# EAGLE design ME433_1 (EAGLE 9.3.2)
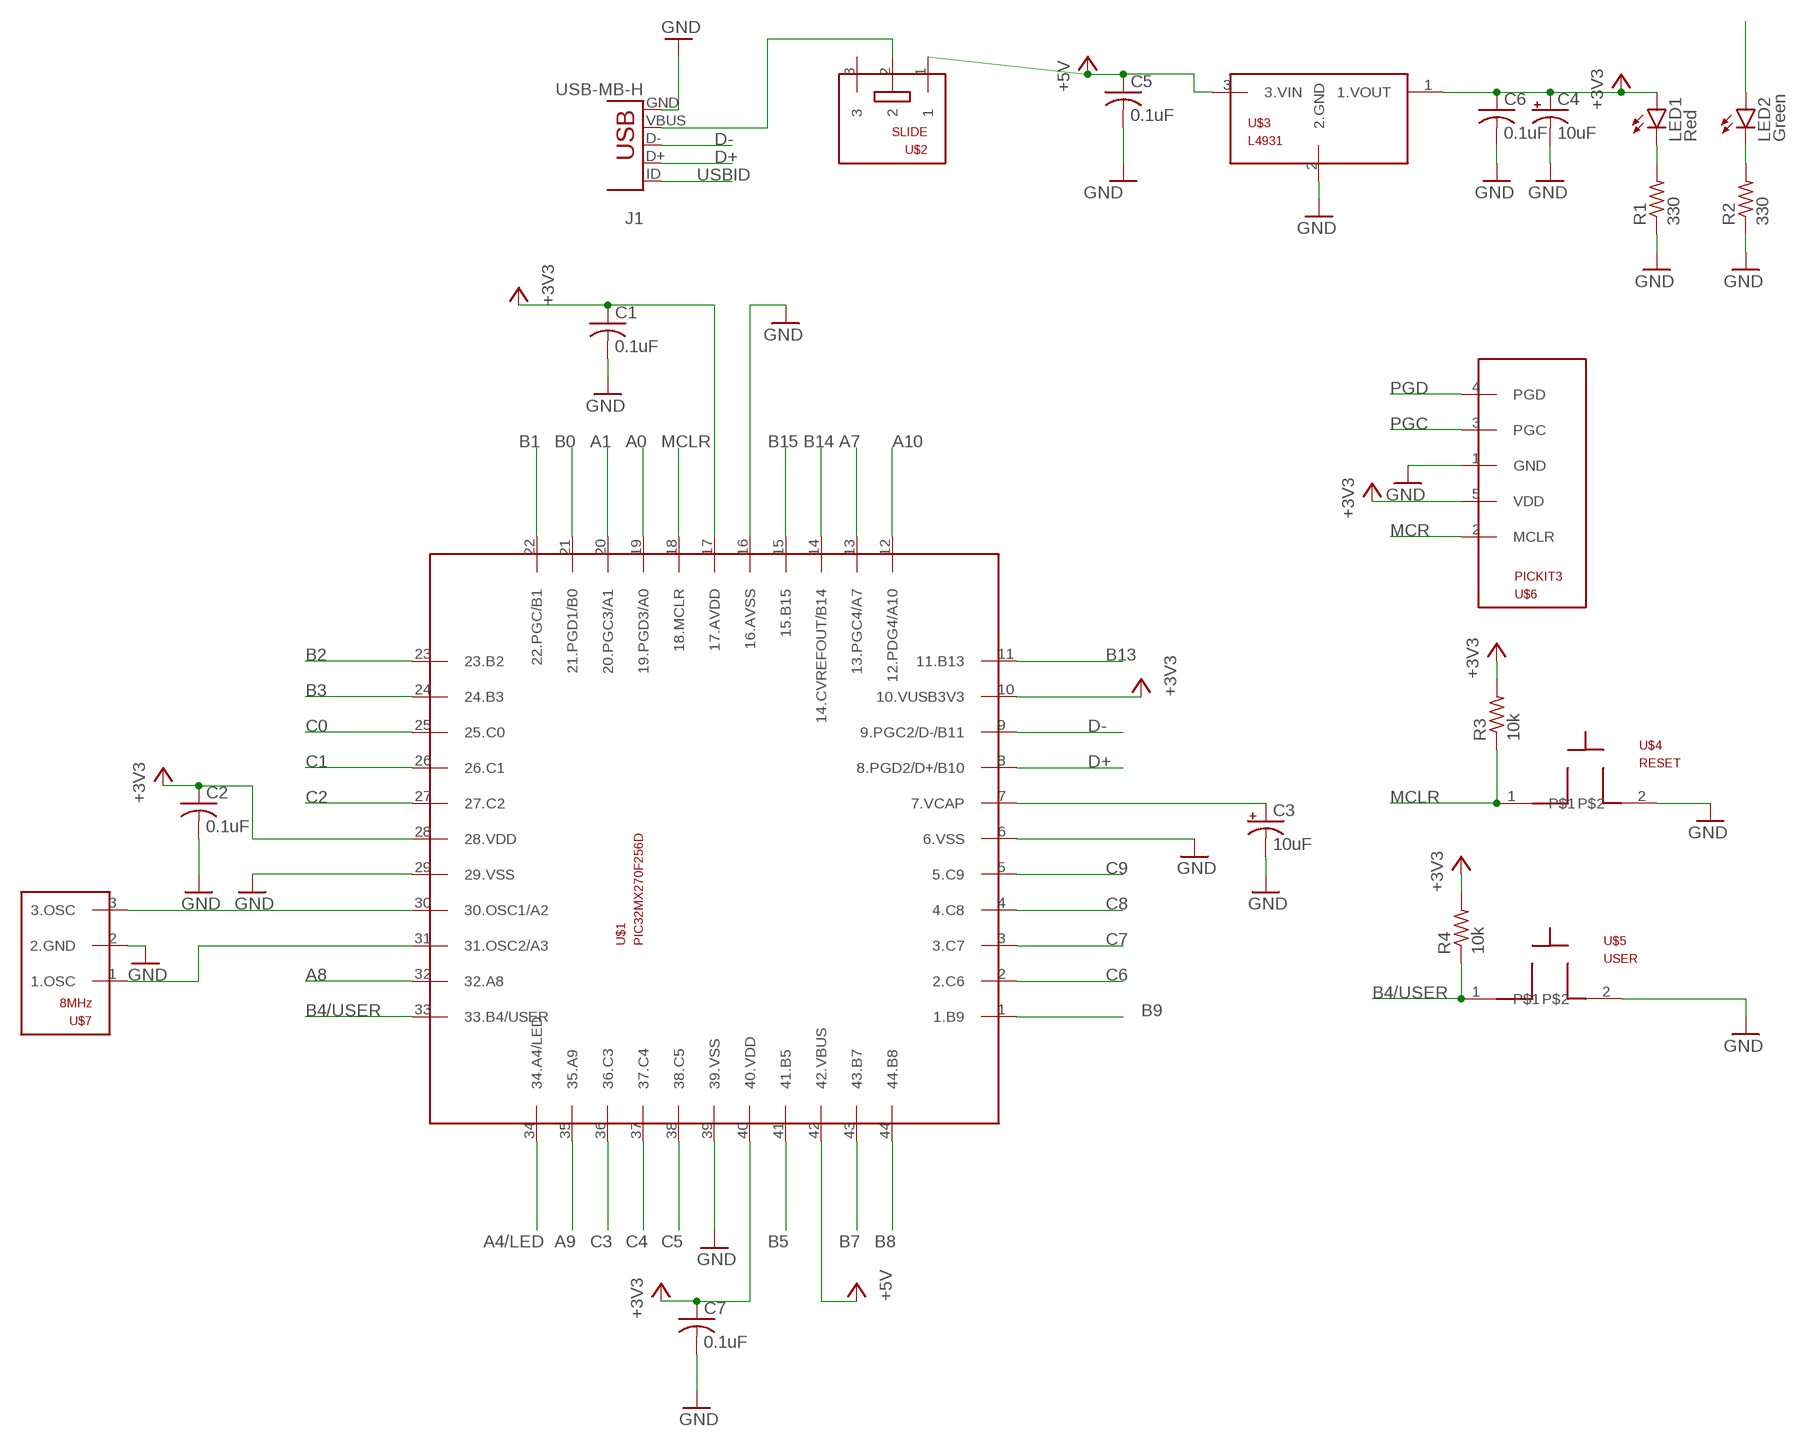
[diagram p0: schematic, sheet 1]

## Parts
C1  0.1uF  C-US025-025X050  [C025-025X050]
C2  0.1uF  C-US025-025X050  [C025-025X050]
C3  10uF  CPOL-USB45181B  [B45181B]
C4  10uF  CPOL-USB45181B  [B45181B]
C5  0.1uF  C-US025-025X050  [C025-025X050]
C6  0.1uF  C-US025-025X050  [C025-025X050]
C7  0.1uF  C-US025-025X050  [C025-025X050]
J1  USB-MB-H  [USB-MB-H]
LED1  Red  LED3MM  [LED3MM]
LED2  Green  LED3MM  [LED3MM]
R1  330  R-US_0207/10  [0207/10]
R2  330  R-US_0207/10  [0207/10]
R3  10k  R-US_0207/10  [0207/10]
R4  10k  R-US_0207/10  [0207/10]
U$1  PIC32MX270F256D  [TQFP44]
U$2  SLIDE  [SLIDE]
U$3  L4931  [1X03VREG]
U$4  RESET  PB  [PB]
U$5  USER  PB  [PB]
U$6  PICKIT3  [1X05]
U$7  8MHz  OSC  [OSC]

## Nets
+3V3: C1.1 C2.1 C4.+ C6.1 C7.1 LED1.A R3.2 R4.2 U$1.10(10.VUSB3V3) U$1.17(17.AVDD) U$1.28(28.VDD) U$1.40(40.VDD) U$3.1(1.VOUT) U$6.5(VDD)
+5V: C5.1 U$1.42(42.VBUS) U$2.1 U$3.3(3.VIN)
A0: U$1.19(19.PGD3/A0)
A1: U$1.20(20.PGC3/A1)
A4/LED: LED2.A U$1.34(34.A4/LED)
A7: U$1.13(13.PGC4/A7)
A8: U$1.32(32.A8)
A9: U$1.35(35.A9)
A10: U$1.12(12.PDG4/A10)
B0: U$1.21(21.PGD1/B0)
B1: U$1.22(22.PGC/B1)
B2: U$1.23(23.B2)
B3: U$1.24(24.B3)
B4/USER: R4.1 U$1.33(33.B4/USER) U$5.1
B5: U$1.41(41.B5)
B7: U$1.43(43.B7)
B8: U$1.44(44.B8)
B9: U$1.1(1.B9)
B13: U$1.11(11.B13)
B14: U$1.14(14.CVREFOUT/B14)
B15: U$1.15(15.B15)
C0: U$1.25(25.C0)
C1: U$1.26(26.C1)
C2: U$1.27(27.C2)
C3: U$1.36(36.C3)
C4: U$1.37(37.C4)
C5: U$1.38(38.C5)
C6: U$1.2(2.C6)
C7: U$1.3(3.C7)
C8: U$1.4(4.C8)
C9: U$1.5(5.C9)
D+: J1.D+ U$1.8(8.PGD2/D+/B10)
D-: J1.D- U$1.9(9.PGC2/D-/B11)
GND: C1.2 C2.2 C3.- C4.- C5.2 C6.2 C7.2 J1.GND R1.1 R2.1 U$1.6(6.VSS) U$1.16(16.AVSS) U$1.29(29.VSS) U$1.39(39.VSS) U$3.2(2.GND) U$4.2 U$5.2 U$6.1(GND) U$7.2(2.GND)
MCLR: R3.1 U$1.18(18.MCLR) U$4.1
MCR: U$6.2(MCLR)
N$1: J1.VBUS U$2.2
N$2: LED1.K(C) R1.2
N$3: LED2.K(C) R2.2
N$4: U$1.30(30.OSC1/A2) U$7.3(3.OSC)
N$5: U$1.31(31.OSC2/A3) U$7.1(1.OSC)
N$6: C3.+ U$1.7(7.VCAP)
PGC: U$6.3(PGC)
PGD: U$6.4(PGD)
USBID: J1.ID
Unconnected: U$2.3

## Library data of the parts
C1 C2 C5-C7 = ME433_1:C-US: CAPACITOR, American symbol; SPICEPREFIX: C
C3 C4 = ME433_1:CPOL-US: POLARIZED CAPACITOR, American symbol; SPICEPREFIX: C
J1 = ME433_1:USB: USB Connectors USB-B-PTH is fully proven SKU : PRT-00139/CONN-08278 USB-miniB is fully proven SKU : PRT-00587 USB-A-PCB is untested. USB-A-H is throughly reviewed, but untested. Spark Fun Electronics SKU : PRT-00437 USB-B-SMT is throughly reviewed, but untested. Needs silkscreen touching up. USB-A-S has not been used/tested USB-MB-H has not been used/tested USB-MICROB has been used. CONN-09505
LED1 LED2 = led:LED: LED OSRAM: - CHIPLED LG R971, LG N971, LY N971, LG Q971, LY Q971, LO R971, LY R971 LH N974, LH R974 LS Q976, LO Q976, LY Q976 LO Q996 - Hyper CHIPLED LW Q18S LB Q993, LB Q99A, LB R99A - SideLED LS A670, LO A670, LY A670, LG A670, LP A670 LB A673, LV A673, LT A673, LW A673 LH A674 LY A675 LS A676, LA A676, LO A676, LY A676, LW A676 LS A679, LY A679, LG A679 - Hyper Micro SIDELED® LS Y876, LA Y876, LO Y876, LY Y876 LT Y87S - SmartLED LW L88C, LW L88S LB L89C, LB L89S, LG L890 LS L89K, LO L89K, LY L89K LS L896, LA L896, LO L896, LY L896 - TOPLED LS T670, LO T670, LY T670, LG T670, LP T670 LSG T670, LSP T670, LSY T670, LOP T670, LYG T670 LG T671, LOG T671, LSG T671 LB T673, LV T673, LT T673, LW T673 LH T674 LS T676, LA T676, LO T676, LY T676, LB T676, LH T676, LSB T676, LW T676 LB T67C, LV T67C, LT T67C, LS T67K, LO T67K, LY T67K, LW E67C LS E67B, LA E67B, LO E67B, LY E67B, LB E67C, LV E67C, LT E67C LW T67C LS T679, LY T679, LG T679 LS T770, LO T770, LY T770, LG T770, LP T770 LB T773, LV T773, LT T773, LW T773 LH T774 LS E675, LA E675, LY E675, LS T675 LS T776, LA T776, LO T776, LY T776, LB T776 LHGB T686 LT T68C, LB T68C - Hyper Mini TOPLED® LB M676 - Mini TOPLED Santana® LG M470 LS M47K, LO M47K, LY M47K Source: http://www.osram.convergy.de LUXEON: - LUMILED® LXK2-PW12-R00, LXK2-PW12-S00, LXK2-PW14-U00, LXK2-PW14-V00 LXK2-PM12-R00, LXK2-PM12-S00, LXK2-PM14-U00 LXK2-PE12-Q00, LXK2-PE12-R00, LXK2-PE12-S00, LXK2-PE14-T00, LXK2-PE14-U00 LXK2-PB12-K00, LXK2-PB12-L00, LXK2-PB12-M00, LXK2-PB14-N00, LXK2-PB14-P00, LXK2-PB14-Q00 LXK2-PR12-L00, LXK2-PR12-M00, LXK2-PR14-Q00, LXK2-PR14-R00 LXK2-PD12-Q00, LXK2-PD12-R00, LXK2-PD12-S00 LXK2-PH12-R00, LXK2-PH12-S00 LXK2-PL12-P00, LXK2-PL12-Q00, LXK2-PL12-R00 Source: www.luxeon.com KINGBRIGHT: KA-3528ASYC Source: www.kingbright.com
R1-R4 = ME433_1:R-US_: RESISTOR, American symbol; SPICEPREFIX: R
U$1 = ME433_1:PIC32MX270F256D
U$2 = ME433_1:SLIDE
U$3 = ME433_1:L4931
U$4 U$5 = ME433_1:PB
U$6 = ME433_1:PICKIT3
U$7 = ME433_1:OSC

## Board
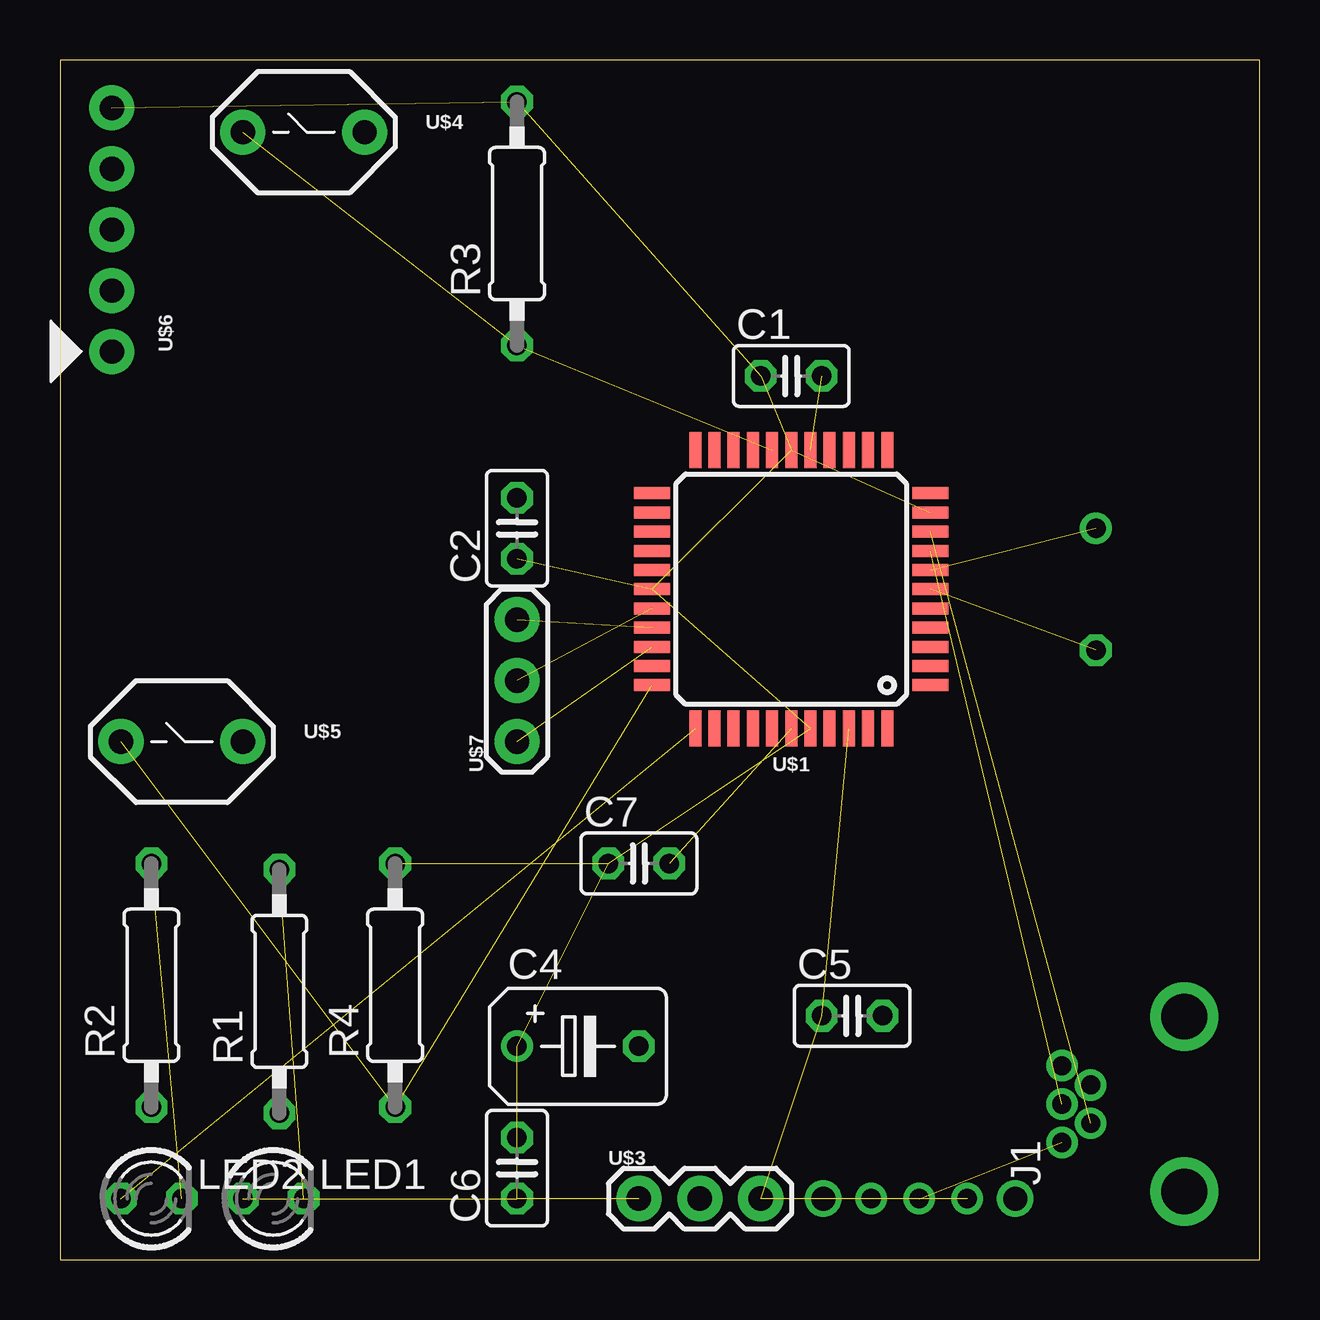
[diagram p1: board, top side]
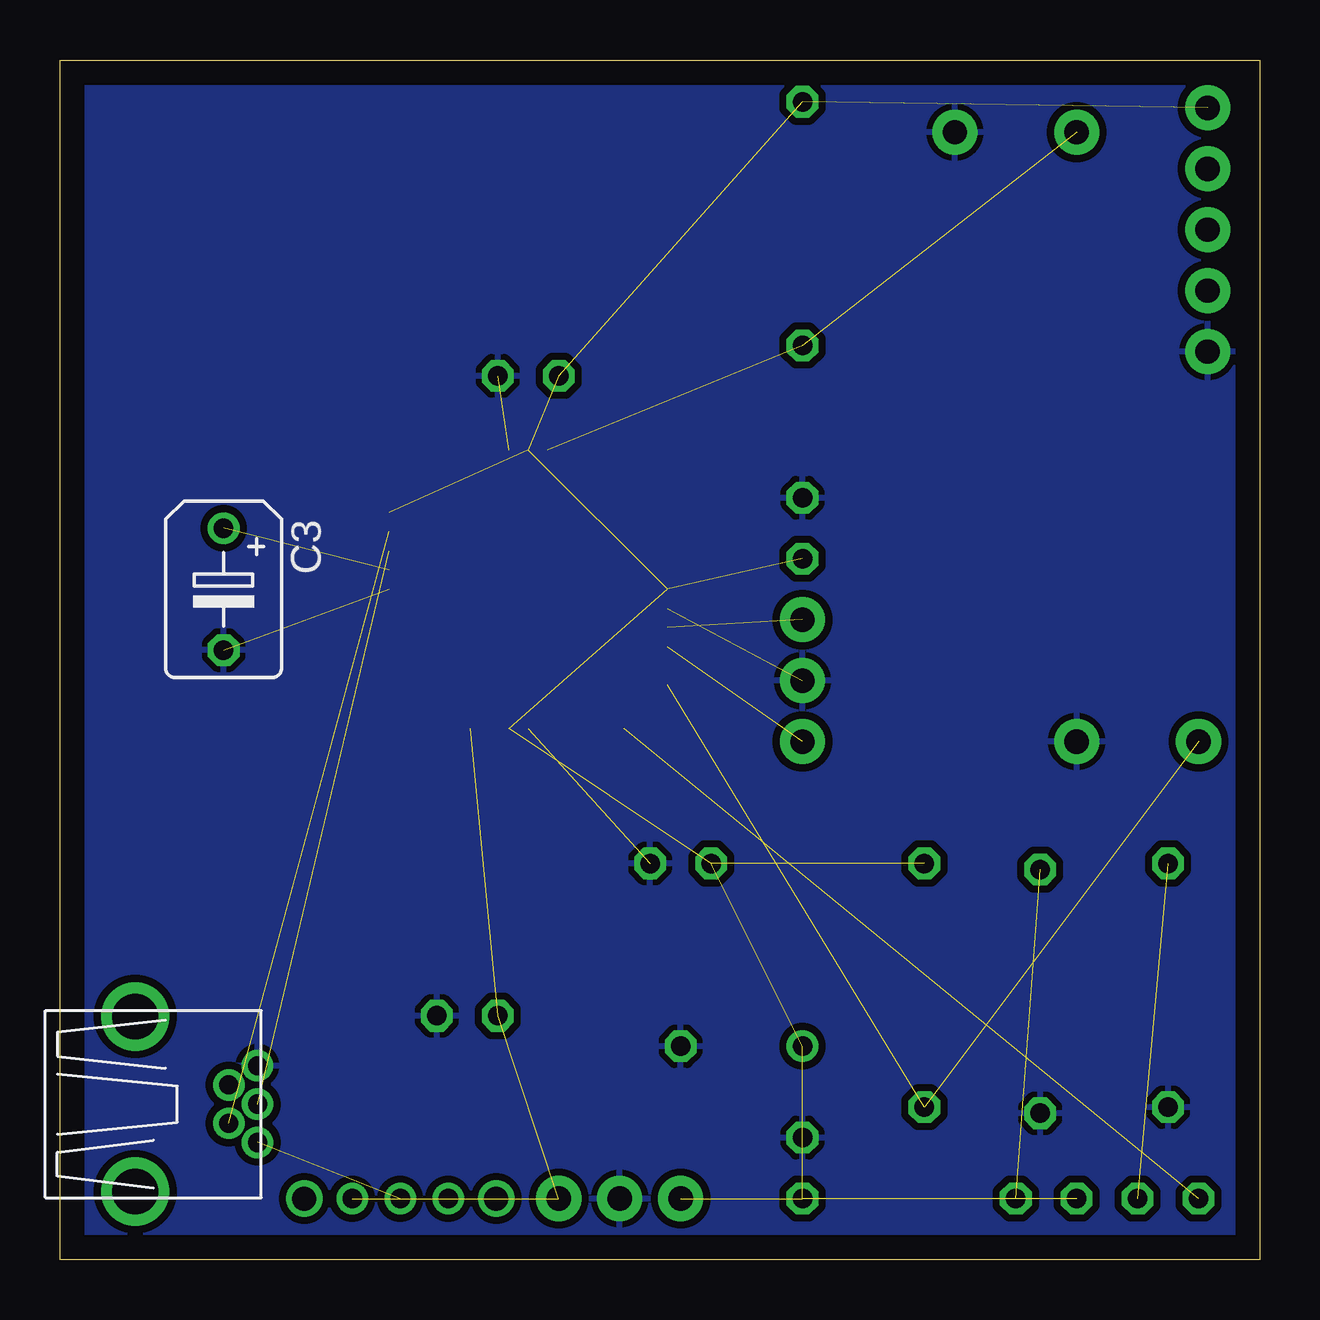
[diagram p2: board, bottom side, seen from below]

Size 50 x 50 mm. Coordinates in mm from the lower left corner, seen from the top.
Outline: 0,0 50,0 50,50 0,50 0,0
Copper layers (1*16): Top 0.035mm / dielectric 1.5mm / Bottom 0.035mm
Design rules "default": minimum track width 6mil, minimum drill 0.35mm, track to track 6mil, track to pad 6mil, pad to pad 6mil, via to via 6mil, smd to smd 6mil, copper to edge 40mil, drill to drill 6mil, minimum pad ring 10mil, minimum via ring 8mil, stop-mask expansion 4mil, vias tented up to drill 0mil, thermal gap 10mil

### Footprints (pad centres in the part's own frame; a part is rotated, then mirrored left to right if it is on the bottom)
C025-025X050 = drill 0.813 octagon: 1 -1.27,0; 2 1.27,0
B45181B = drill 0.813: + -2.54,0 | drill 0.813 octagon: - 2.54,0
USB-MB-H = drill 0.8: D+ 5.1,0; D- 3.9,0.8; GND 5.1,-1.6; ID 3.9,-0.8; VBUS 5.1,1.6 | drill 1.9: P$6 0,-3.65; P$7 0,3.65
LED3MM = drill 0.813 octagon: A -1.27,0; K 1.27,0
0207/10 = drill 0.813 octagon: 1 -5.08,0; 2 5.08,0
TQFP44 = smd 1.5 x 0.5: 1 -5.8,4; 2 -5.8,3.2; 3 -5.8,2.4; 4 -5.8,1.6; 5 -5.8,0.8; 6 -5.8,0; 7 -5.8,-0.8; 8 -5.8,-1.6; 9 -5.8,-2.4; 10 -5.8,-3.2; 11 -5.8,-4; 23 5.8,-4; 24 5.8,-3.2; 25 5.8,-2.4; 26 5.8,-1.6; 27 5.8,-0.8; 28 5.8,0; 29 5.8,0.8; 30 5.8,1.6; 31 5.8,2.4; 32 5.8,3.2; 33 5.8,4 | smd 0.5 x 1.5: 12 -4,-5.8; 13 -3.2,-5.8; 14 -2.4,-5.8; 15 -1.6,-5.8; 16 -0.8,-5.8; 17 0,-5.8; 18 0.8,-5.8; 19 1.6,-5.8; 20 2.4,-5.8; 21 3.2,-5.8; 22 4,-5.8; 34 4,5.8; 35 3.2,5.8; 36 2.4,5.8; 37 1.6,5.8; 38 0.8,5.8; 39 0,5.8; 40 -0.8,5.8; 41 -1.6,5.8; 42 -2.4,5.8; 43 -3.2,5.8; 44 -4,5.8
SLIDE = drill 0.8: 1 -2,0; 2 0,0; 3 2,0 | drill 1: P$1 -4,0; P$2 4,0
1X03VREG = drill 1.016 pad 1.88: 1 0,0; 2 2.54,0; 3 5.08,0
PB = drill 1.016 pad 1.88: 1 -2.54,0; 2 2.54,0
1X05 = drill 1.016 pad 1.88: 1 0,0; 2 2.54,0; 3 5.08,0; 4 7.62,0; 5 10.16,0
OSC = drill 1.016 pad 1.88: 1 -2.54,0; 2 0,0; 3 2.54,0

### Placement (x,y rotation side)
C1  30.48,36.83 0 top
C2  19.05,30.48 90 top
C3  43.18,27.94 270 bottom
C4  21.59,8.89 0 top
C5  33.02,10.16 0 top
C6  19.05,3.81 90 top
C7  24.13,16.51 0 top
J1  46.86,6.48 180 top
LED1  8.89,2.54 0 top
LED2  3.81,2.54 0 top
R1  9.14,11.18 90 top
R2  3.81,11.43 90 top
R3  19.05,43.18 90 top
R4  13.97,11.43 90 top
U$1  30.48,27.94 180 top
U$2  35.81,2.54 180 top
U$3  24.13,2.54 0 top
U$4  10.16,46.99 0 top
U$5  5.08,21.59 0 top
U$6  2.16,37.85 90 top
U$7  19.05,24.13 90 top

### Tracks (layer width: path | path; a pad name or v marks a point on that pad's centre or on a via)
+3V3  (13 unrouted)
+5V  (3 unrouted)
A4/LED  (1 unrouted)
B4/USER  (2 unrouted)
D+  (1 unrouted)
D-  (1 unrouted)
GND  (4 unrouted)
  pour Bottom (isolate 0.305): 0,49.53 49.53,49.53 49.53,0 0,0
MCLR  (2 unrouted)
N$1  (1 unrouted)
N$2  (1 unrouted)
N$3  (1 unrouted)
N$4  (1 unrouted)
N$5  (1 unrouted)
N$6  (1 unrouted)